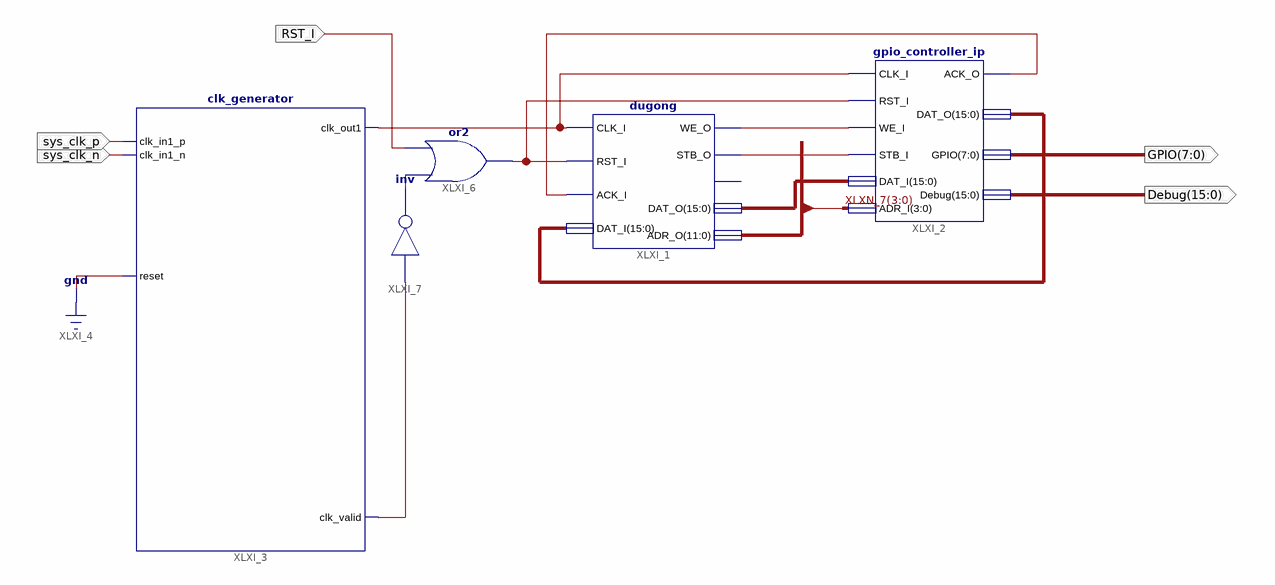
[diagram p0: schematic sheet 1]
// Xilinx ISE schematic prototype0.sch (spartan6) as structural Verilog: 5 symbols, 5 ports
module prototype0 (
  input  RST_I,
  input  sys_clk_n,
  input  sys_clk_p,
  output [7:0] GPIO,
  output [15:0] Debug
);

  wire CLK_I, XLXN_1, XLXN_2, XLXN_5, XLXN_10, XLXN_11, XLXN_13;
  wire [11:0] XLXN_7;
  wire [15:0] XLXN_3, XLXN_6;

  clk_generator XLXI_3 (
    .clk_in1_p(sys_clk_p), .clk_in1_n(sys_clk_n), .reset(1'b0), .clk_out1(CLK_I), .clk_valid(XLXN_11));
  dugong XLXI_1 (
    .CLK_I(CLK_I), .RST_I(XLXN_13), .ACK_I(XLXN_5), .DAT_I(XLXN_6), .WE_O(XLXN_1), .STB_O(XLXN_2),
    .DAT_O(XLXN_3), .ADR_O(XLXN_7));  // open: CYC_O
  gpio_controller_ip XLXI_2 (
    .CLK_I(CLK_I), .RST_I(XLXN_13), .WE_I(XLXN_1), .STB_I(XLXN_2), .DAT_I(XLXN_3), .ADR_I(XLXN_7[3:0]),
    .ACK_O(XLXN_5), .DAT_O(XLXN_6), .GPIO(GPIO), .Debug(Debug));
  or XLXI_6 (XLXN_13, XLXN_10, RST_I);
  not XLXI_7 (XLXN_10, XLXN_11);
endmodule
